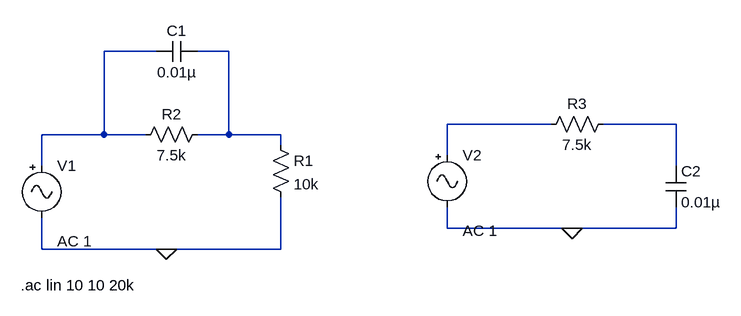
[diagram p0: schematic RC-prede.asc]
RC-prede.asc, the LTspice schematic file:
Version 4.1
SHEET 1 940 680
WIRE 64 -64 -16 -64
WIRE 176 -64 128 -64
WIRE 672 48 512 48
WIRE 864 48 752 48
WIRE -16 64 -16 -64
WIRE -16 64 -112 64
WIRE 48 64 -16 64
WIRE 176 64 176 -64
WIRE 176 64 128 64
WIRE 256 64 176 64
WIRE 256 80 256 64
WIRE 512 96 512 48
WIRE -112 112 -112 64
WIRE 864 112 864 48
WIRE 512 208 512 176
WIRE 704 208 512 208
WIRE 864 208 864 176
WIRE 864 208 704 208
WIRE -112 240 -112 192
WIRE 80 240 -112 240
WIRE 256 240 256 160
WIRE 256 240 80 240
FLAG 80 240 0
FLAG 704 208 0
SYMBOL res 240 64 R0
SYMATTR InstName R1
SYMATTR Value 10k
SYMBOL res 144 48 R90
WINDOW 0 0 56 VBottom 2
WINDOW 3 32 56 VTop 2
SYMATTR InstName R2
SYMATTR Value 7.5k
SYMBOL cap 128 -80 R90
WINDOW 0 0 32 VBottom 2
WINDOW 3 32 32 VTop 2
SYMATTR InstName C1
SYMATTR Value 0.01µ
SYMBOL Misc\\signal -112 96 R0
WINDOW 123 24 132 Left 2
WINDOW 39 0 0 Left 0
SYMATTR Value2 AC 1
SYMATTR InstName V1
SYMATTR Value ""
SYMBOL Misc\\signal 512 80 R0
WINDOW 123 24 132 Left 2
WINDOW 39 0 0 Left 0
SYMATTR InstName V2
SYMATTR Value ""
SYMATTR Value2 AC 1
SYMBOL res 768 32 R90
WINDOW 0 0 56 VBottom 2
WINDOW 3 32 56 VTop 2
SYMATTR InstName R3
SYMATTR Value 7.5k
SYMBOL cap 848 112 R0
SYMATTR InstName C2
SYMATTR Value 0.01µ
TEXT -144 296 Left 2 !.ac lin 10 10 20k

The netlist it stands for:
* RC-prede.asc
R1 N002 0 10k
R2 N002 N001 7.5k
C1 N002 N001 0.01µ
V1 N001 0 AC 1
V2 N003 0 AC 1
R3 N004 N003 7.5k
C2 N004 0 0.01µ
.ac lin 10 10 20k
.backanno
.end